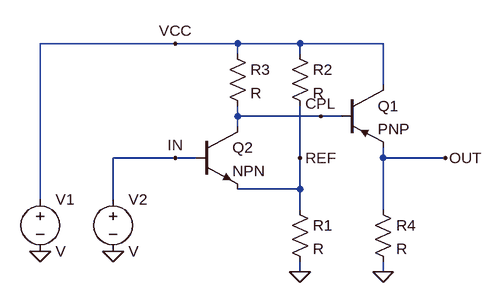
[diagram p0: schematic Draft1.asc]
Draft1.asc, the LTspice schematic file:
Version 4
SHEET 1 880 680
WIRE -16 -288 -224 -288
WIRE 80 -288 -16 -288
WIRE 176 -288 80 -288
WIRE 304 -288 176 -288
WIRE 80 -272 80 -288
WIRE 176 -272 176 -288
WIRE 304 -224 304 -288
WIRE 80 -176 80 -192
WIRE 208 -176 80 -176
WIRE 240 -176 208 -176
WIRE 80 -160 80 -176
WIRE -16 -112 -112 -112
WIRE 16 -112 -16 -112
WIRE 176 -112 176 -192
WIRE 304 -112 304 -128
WIRE 400 -112 304 -112
WIRE 176 -64 176 -112
WIRE 176 -64 80 -64
WIRE -224 -48 -224 -288
WIRE -112 -48 -112 -112
WIRE 176 -32 176 -64
WIRE 304 -32 304 -112
WIRE 176 64 176 48
WIRE 304 64 304 48
FLAG 176 64 0
FLAG 304 64 0
FLAG -224 32 0
FLAG -112 32 0
FLAG -16 -288 VCC
FLAG -16 -112 IN
FLAG 176 -112 REF
FLAG 400 -112 OUT
FLAG 208 -176 CPL
SYMBOL pnp 240 -224 R0
SYMATTR InstName Q1
SYMBOL npn 16 -160 R0
SYMATTR InstName Q2
SYMBOL res 160 -48 R0
SYMATTR InstName R1
SYMBOL res 160 -288 R0
SYMATTR InstName R2
SYMBOL res 64 -288 R0
SYMATTR InstName R3
SYMBOL res 288 -48 R0
SYMATTR InstName R4
SYMBOL voltage -224 -64 R0
SYMATTR InstName V1
SYMBOL voltage -112 -64 R0
SYMATTR InstName V2

The netlist it stands for:
* Draft1.asc
Q1 VCC CPL OUT 0 PNP
Q2 CPL IN REF 0 NPN
R1 REF 0 R
R2 VCC REF R
R3 VCC CPL R
R4 OUT 0 R
V1 VCC 0 V
V2 IN 0 V
.model NPN NPN
.model PNP PNP
.lib standard.bjt
.backanno
.end